# Altium schematic sheet GateDriverSketch.SchDoc
size A4; SheetNumber: 3; SheetTotal: 8
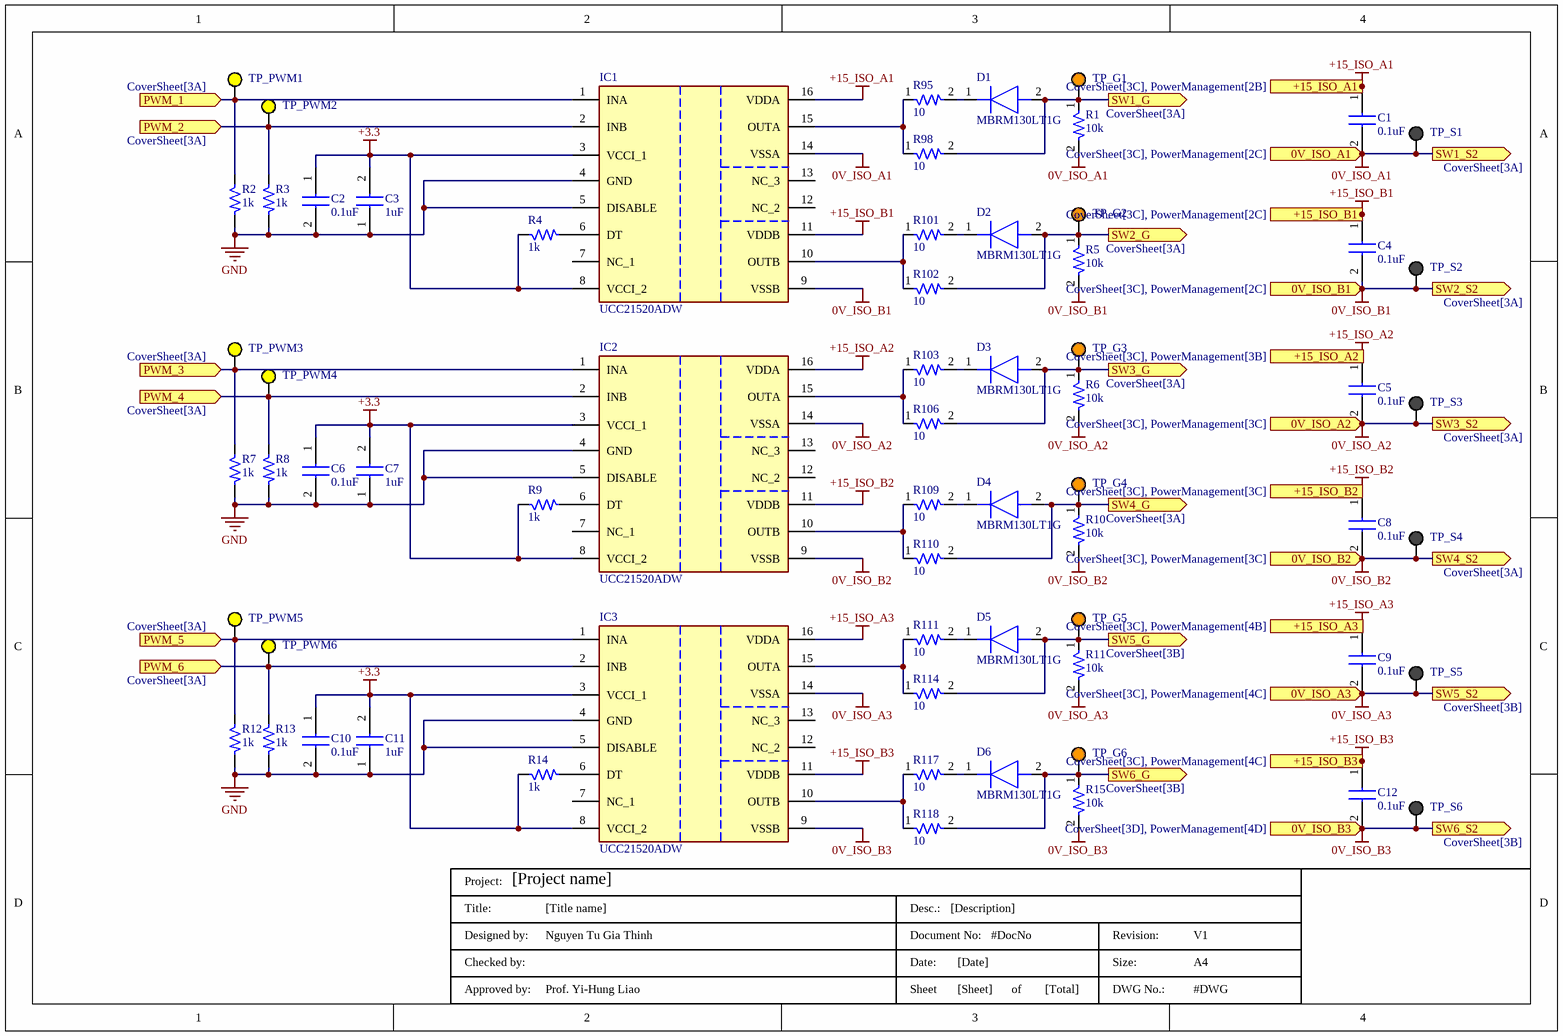
[diagram p0: GateDriverSketch.SchDoc]

## Parts
C1  0.1uF  [C0805]
C2  0.1uF  [C0805]
C3  1uF  [CAPC2012X145N]
C4  0.1uF  [C0805]
C5  0.1uF  [C0805]
C6  0.1uF  [C0805]
C7  1uF  [CAPC2012X145N]
C8  0.1uF  [C0805]
C9  0.1uF  [C0805]
C10  0.1uF  [C0805]
C11  1uF  [CAPC2012X145N]
C12  0.1uF  [C0805]
D1  MBRM130LT1G  [MBRM130LT1G]
D2  MBRM130LT1G  [MBRM130LT1G]
D3  MBRM130LT1G  [MBRM130LT1G]
D4  MBRM130LT1G  [MBRM130LT1G]
D5  MBRM130LT1G  [MBRM130LT1G]
D6  MBRM130LT1G  [MBRM130LT1G]
IC1  UCC21520ADW  [SOIC127P1030X265-16N]
IC2  UCC21520ADW  [SOIC127P1030X265-16N]
IC3  UCC21520ADW  [SOIC127P1030X265-16N]
R1  10k  [RESC2012X50N]
R2  1k  [SM-1206]
R3  1k  [SM-1206]
R4  1k  [SM-1206]
R5  10k  [RESC2012X50N]
R6  10k  [RESC2012X50N]
R7  1k  [SM-1206]
R8  1k  [SM-1206]
R9  1k  [SM-1206]
R10  10k  [RESC2012X50N]
R11  10k  [RESC2012X50N]
R12  1k  [SM-1206]
R13  1k  [SM-1206]
R14  1k  [SM-1206]
R15  10k  [RESC2012X50N]
R95  10  [RESC2012X50N]
R98  10  [RESC2012X50N]
R101  10  [RESC2012X50N]
R102  10  [RESC2012X50N]
R103  10  [RESC2012X50N]
R106  10  [RESC2012X50N]
R109  10  [RESC2012X50N]
R110  10  [RESC2012X50N]
R111  10  [RESC2012X50N]
R114  10  [RESC2012X50N]
R117  10  [RESC2012X50N]
R118  10  [RESC2012X50N]
TitleBlock  DWG No.: #DWG  Size:: A4  Revision:: V1  Total of Sheets: [Total]  Sheet: [Sheet]  Date:: [Date]  Document No:: #DocNo  Desc.:: [Description]  Approved by:: Prof. Yi-Hung Liao  Designed by:: Nguyen Tu Gia Thinh  Title:: [Title name]  Project: [Project name]  (hidden comment: TitleBlock)  (graphical)
TP_G1  (no value)  [5003]
TP_G2  (no value)  [5003]
TP_G3  (no value)  [5003]
TP_G4  (no value)  [5003]
TP_G5  (no value)  [5003]
TP_G6  (no value)  [5003]
TP_PWM1  (no value)  [5004]
TP_PWM2  (no value)  [5004]
TP_PWM3  (no value)  [5004]
TP_PWM4  (no value)  [5004]
TP_PWM5  (no value)  [5004]
TP_PWM6  (no value)  [5004]
TP_S1  (no value)  [5001]
TP_S2  (no value)  [5001]
TP_S3  (no value)  [5001]
TP_S4  (no value)  [5001]
TP_S5  (no value)  [5001]
TP_S6  (no value)  [5001]

## Ports
0V_ISO_A1 (in, see CoverSheet[3C], PowerManagement[2C]), 0V_ISO_A2 (in, see CoverSheet[3C], PowerManagement[3C]), 0V_ISO_A3 (in, see CoverSheet[3C], PowerManagement[4C]), 0V_ISO_B1 (in, see CoverSheet[3C], PowerManagement[2C]), 0V_ISO_B2 (in, see CoverSheet[3C], PowerManagement[3C]), 0V_ISO_B3 (in, see CoverSheet[3D], PowerManagement[4D]), +15_ISO_A1 (in, see CoverSheet[3C], PowerManagement[2B]), +15_ISO_A2 (in, see CoverSheet[3C], PowerManagement[3B]), +15_ISO_A3 (in, see CoverSheet[3C], PowerManagement[4B]), +15_ISO_B1 (in, see CoverSheet[3C], PowerManagement[2C]), +15_ISO_B2 (in, see CoverSheet[3C], PowerManagement[3C]), +15_ISO_B3 (in, see CoverSheet[3C], PowerManagement[4C]), PWM_1 (in, see CoverSheet[3A]), PWM_2 (in, see CoverSheet[3A]), PWM_3 (in, see CoverSheet[3A]), PWM_4 (in, see CoverSheet[3A]), PWM_5 (in, see CoverSheet[3A]), PWM_6 (in, see CoverSheet[3A]), SW1_G (out, see CoverSheet[3A]), SW1_S2 (out, see CoverSheet[3A]), SW2_G (out, see CoverSheet[3A]), SW2_S2 (out, see CoverSheet[3A]), SW3_G (out, see CoverSheet[3A]), SW3_S2 (out, see CoverSheet[3A]), SW4_G (out, see CoverSheet[3A]), SW4_S2 (out, see CoverSheet[3A]), SW5_G (out, see CoverSheet[3B]), SW5_S2 (out, see CoverSheet[3B]), SW6_G (out, see CoverSheet[3B]), SW6_S2 (out, see CoverSheet[3B])

## Nets
0V_ISO_A1: C1.2 IC1.14(VSSA) R1.2 TP_S1.1 ; port SW1_S2, port 0V_ISO_A1
0V_ISO_A2: C5.2 IC2.14(VSSA) R6.2 TP_S3.1 ; port SW3_S2, port 0V_ISO_A2
0V_ISO_A3: C9.2 IC3.14(VSSA) R11.2 TP_S5.1 ; port SW5_S2, port 0V_ISO_A3
0V_ISO_B1: C4.2 IC1.9(VSSB) R5.2 TP_S2.1 ; port SW2_S2, port 0V_ISO_B1
0V_ISO_B2: C8.2 IC2.9(VSSB) R10.2 TP_S4.1 ; port SW4_S2, port 0V_ISO_B2
0V_ISO_B3: C12.2 IC3.9(VSSB) R15.2 TP_S6.1 ; port SW6_S2, port 0V_ISO_B3
+15_ISO_A1: C1.1 IC1.16(VDDA) ; port +15_ISO_A1
+15_ISO_A2: C5.1 IC2.16(VDDA)
+15_ISO_A3: C9.1 IC3.16(VDDA) ; port +15_ISO_A3
+15_ISO_B1: C4.1 IC1.11(VDDB) ; port +15_ISO_B1
+15_ISO_B2: C8.1 IC2.11(VDDB) ; port +15_ISO_B2
+15_ISO_B3: C12.1 IC3.11(VDDB) ; port +15_ISO_B3
GND: C2.2 C3.1 C6.2 C7.1 C10.2 C11.1 IC1.4(GND) IC1.5(DISABLE) IC2.4(GND) IC2.5(DISABLE) IC3.4(GND) IC3.5(DISABLE) R2.2 R3.2 R7.2 R8.2 R12.2 R13.2
PWM_1: IC1.1(INA) R2.1 TP_PWM1.1 ; port PWM_1
PWM_2: IC1.2(INB) R3.1 TP_PWM2.1 ; port PWM_2
PWM_3: IC2.1(INA) R7.1 TP_PWM3.1 ; port PWM_3
PWM_4: IC2.2(INB) R8.1 TP_PWM4.1 ; port PWM_4
PWM_5: IC3.1(INA) R12.1 TP_PWM5.1 ; port PWM_5
PWM_6: IC3.2(INB) R13.1 TP_PWM6.1 ; port PWM_6
SW1_G: D1.2(A) R1.1 R98.2 TP_G1.1 ; port SW1_G
SW2_G: D2.2(A) R5.1 R102.2 TP_G2.1 ; port SW2_G
SW3_G: D3.2(A) R6.1 R106.2 TP_G3.1 ; port SW3_G
SW4_G: D4.2(A) R10.1 R110.2 TP_G4.1 ; port SW4_G
SW5_G: D5.2(A) R11.1 R114.2 TP_G5.1 ; port SW5_G
SW6_G: D6.2(A) R15.1 R118.2 TP_G6.1 ; port SW6_G
NetC2_1: C2.1 C3.2 IC1.3(VCCI_1) IC1.8(VCCI_2) R4.1
NetC6_1: C6.1 C7.2 IC2.3(VCCI_1) IC2.8(VCCI_2) R9.1
NetC10_1: C10.1 C11.2 IC3.3(VCCI_1) IC3.8(VCCI_2) R14.1
NetD1_1: D1.1(K) R95.2
NetD2_1: D2.1(K) R101.2
NetD3_1: D3.1(K) R103.2
NetD4_1: D4.1(K) R109.2
NetD5_1: D5.1(K) R111.2
NetD6_1: D6.1(K) R117.2
NetIC1_6: IC1.6(DT) R4.2
NetIC1_10: IC1.10(OUTB) R101.1 R102.1
NetIC1_15: IC1.15(OUTA) R95.1 R98.1
NetIC2_6: IC2.6(DT) R9.2
NetIC2_10: IC2.10(OUTB) R109.1 R110.1
NetIC2_15: IC2.15(OUTA) R103.1 R106.1
NetIC3_6: IC3.6(DT) R14.2
NetIC3_10: IC3.10(OUTB) R117.1 R118.1
NetIC3_15: IC3.15(OUTA) R111.1 R114.1

Not connected (* = marked no-connect by the designer): IC1 7(NC_1) 12(NC_2) 13(NC_3); IC2 7(NC_1) 12(NC_2) 13(NC_3); IC3 7(NC_1) 12(NC_2) 13(NC_3)

## Notes on the sheet
- Labels drawn without touching a wire or pin: +3.3
- (in symbol Title Block 2) Project:; Title:; Desc.:; Designed by:; Document No:; Revision:; Checked by:; Date:; Size:; Approved by:; Sheet; of; DWG No.:

## Library data of the parts
C1 C2 C4-C6 C8-C10 C12 = C0805C104K3RACTU: Capacitor; Manufacturer_Name: KEMET; Datasheet Link: https://content.kemet.com/datasheets/KEM_C1002_X7R_SMD.pdf; Height: 1.1mm; Manufacturer_Part_Number: C0805C104K3RACTU; Mouser Part Number: 80-C0805C104K3R; Mouser Price/Stock: https://www.mouser.co.uk/ProductDetail/KEMET/C0805C104K3RACTU?qs=zZwvocWqSRjmUvfNxkIN%2Fg%3D%3D; Arrow Part Number: C0805C104K3RACTU; Arrow Price/Stock: https://www.arrow.com/en/products/c0805c104k3ractu/kemet-corporation; Capacitance: 0.1uF
C3 C7 C11 = GRM21BR71H105KA12L: Capacitor; Manufacturer_Name: Murata Electronics; Datasheet Link: http://www.murata.com/~/media/webrenewal/support/library/catalog/products/capacitor/mlcc/c02e.pdf; Height: 1.45mm; Manufacturer_Part_Number: GRM21BR71H105KA12L; Mouser Part Number: 81-GRM21BR71H105KA2L; Mouser Price/Stock: https://www.mouser.co.uk/ProductDetail/Murata-Electronics/GRM21BR71H105KA12L?qs=Er06SXQpt%252B60EIT%2FJ7%2F41Q%3D%3D; Arrow Part Number: GRM21BR71H105KA12L; Arrow Price/Stock: https://www.arrow.com/en/products/grm21br71h105ka12l/murata-manufacturing
D1-D6 = MBRM130LT1G: Diode; Manufacturer_Name: onsemi; Datasheet Link: http://www.onsemi.com/pub/Collateral/MBRM130L-D.PDF; Manufacturer_Part_Number: MBRM130LT1G; Mouser Part Number: 863-MBRM130LT1G; Mouser Price/Stock: https://www.mouser.co.uk/ProductDetail/onsemi/MBRM130LT1G?qs=3JMERSakebrXPEmSbT3BNg%3D%3D; Arrow Part Number: MBRM130LT1G; Arrow Price/Stock: https://www.arrow.com/en/products/mbrm130lt1g/on-semiconductor?region=europe
IC1-IC3 = UCC21520ADW: Integrated Circuit; Manufacturer_Name: Texas Instruments; Datasheet Link: http://www.ti.com/lit/gpn/ucc21520; Height: 2.65mm; Manufacturer_Part_Number: UCC21520ADW; Mouser Part Number: 595-UCC21520ADW; Mouser Price/Stock: https://www.mouser.co.uk/ProductDetail/Texas-Instruments/UCC21520ADW?qs=%2FP2Ij7fVdhFsQr%252B%2F6P1laA%3D%3D; Arrow Part Number: UCC21520ADW; Arrow Price/Stock: https://www.arrow.com/en/products/ucc21520adw/texas-instruments?region=europe
R1 R5 R6 R10 R11 R15 R95 R98 R101-R103 R106 R109-R111 R114 R117 R118 = CRCW0805470RFKEA_1: Resistor; Manufacturer_Name: Vishay; Datasheet Link: http://www.vishay.com/docs/20035/dcrcwe3.pdf; Height: 0.5mm; Manufacturer_Part_Number: CRCW0805470RFKEA; Mouser Part Number: 71-CRCW0805-470-E3; Mouser Price/Stock: https://www.mouser.co.uk/ProductDetail/Vishay-Dale/CRCW0805470RFKEA?qs=H9nSDuxQXAFXsHHWFcTSWg%3D%3D; Arrow Part Number: CRCW0805470RFKEA; Arrow Price/Stock: https://www.arrow.com/en/products/crcw0805470rfkea/vishay
R2-R4 R7-R9 R12-R14 = R: Resistor 1/4W; Value: R1/4W - 1K
TitleBlock = Title Block 2
TP_G1-TP_G6 = 5003: Test Point Orrange, Multipurpose, TH
TP_PWM1-TP_PWM6 = 5004: Test Point Yellow, Multipurpose, TH
TP_S1-TP_S6 = 5001: Test Point Black, Multipurpose, TH